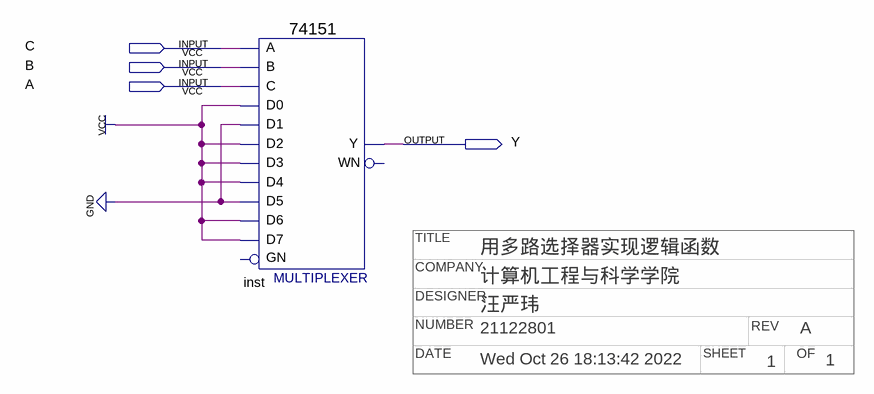
[diagram p0: schematic sheet]
// Quartus schematic 74LS151.bdf as structural Verilog: 1 symbols, 4 pins
// Title block: TITLE: 用多路选择器实现逻辑函数; COMPANY: 计算机工程与科学学院; DESIGNER: 汪严玮; NUMBER: 21122801; REV: A; DATE: Wed Oct 26 18:13:42 2022; SHEET: 1; OF: 1
module \74LS151  (
  input  C,
  input  B,
  input  A,
  output Y
);

  \74151  inst (
    .C(A), .B(B), .A(C), .D5(1'b0), .D0(1'b1), .D1(1'b0), .D4(1'b1), .D3(1'b1), .D2(1'b1), .D6(1'b1),
    .D7(1'b1), .Y(Y));  // open: GN, WN
endmodule
